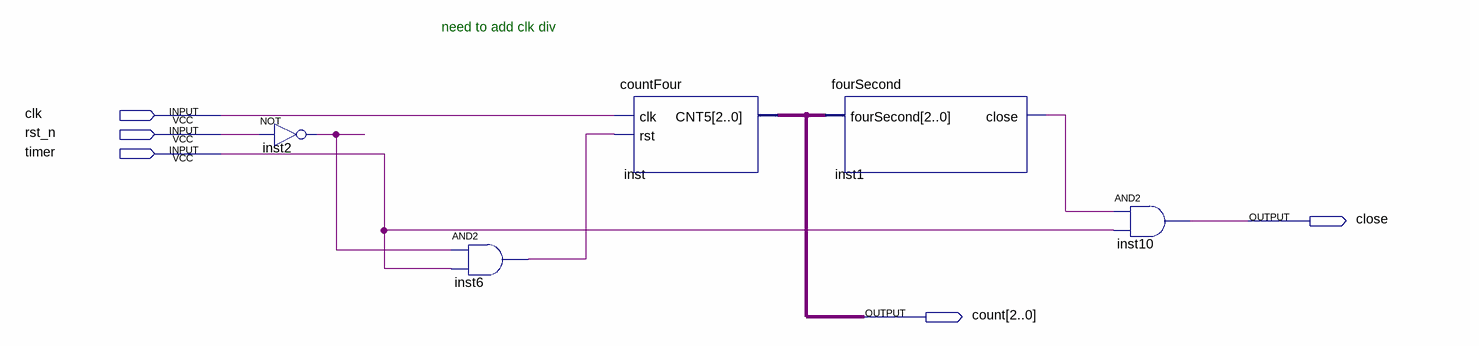
[diagram p0: schematic sheet]
// Quartus schematic timer.bdf as structural Verilog: 5 symbols, 5 pins
module timer (
  input  clk,
  input  rst_n,
  input  timer,
  output close,
  output [2:0] count
);

  wire inst1_close, inst2_out, inst6_out;

  not inst2 (inst2_out, rst_n);
  and inst6 (inst6_out, inst2_out, timer);
  countFour inst (.clk(clk), .rst(inst6_out), .CNT5(count));
  fourSecond inst1 (.fourSecond(count), .close(inst1_close));
  and inst10 (close, inst1_close, timer);

  // Notes on the sheet:
  //   need to add clk div
endmodule
